# Altium schematic sheet MAKO_pH_sensor_schematic.SchDoc
size A2 portrait; SheetNumber: 1; SheetTotal: 1
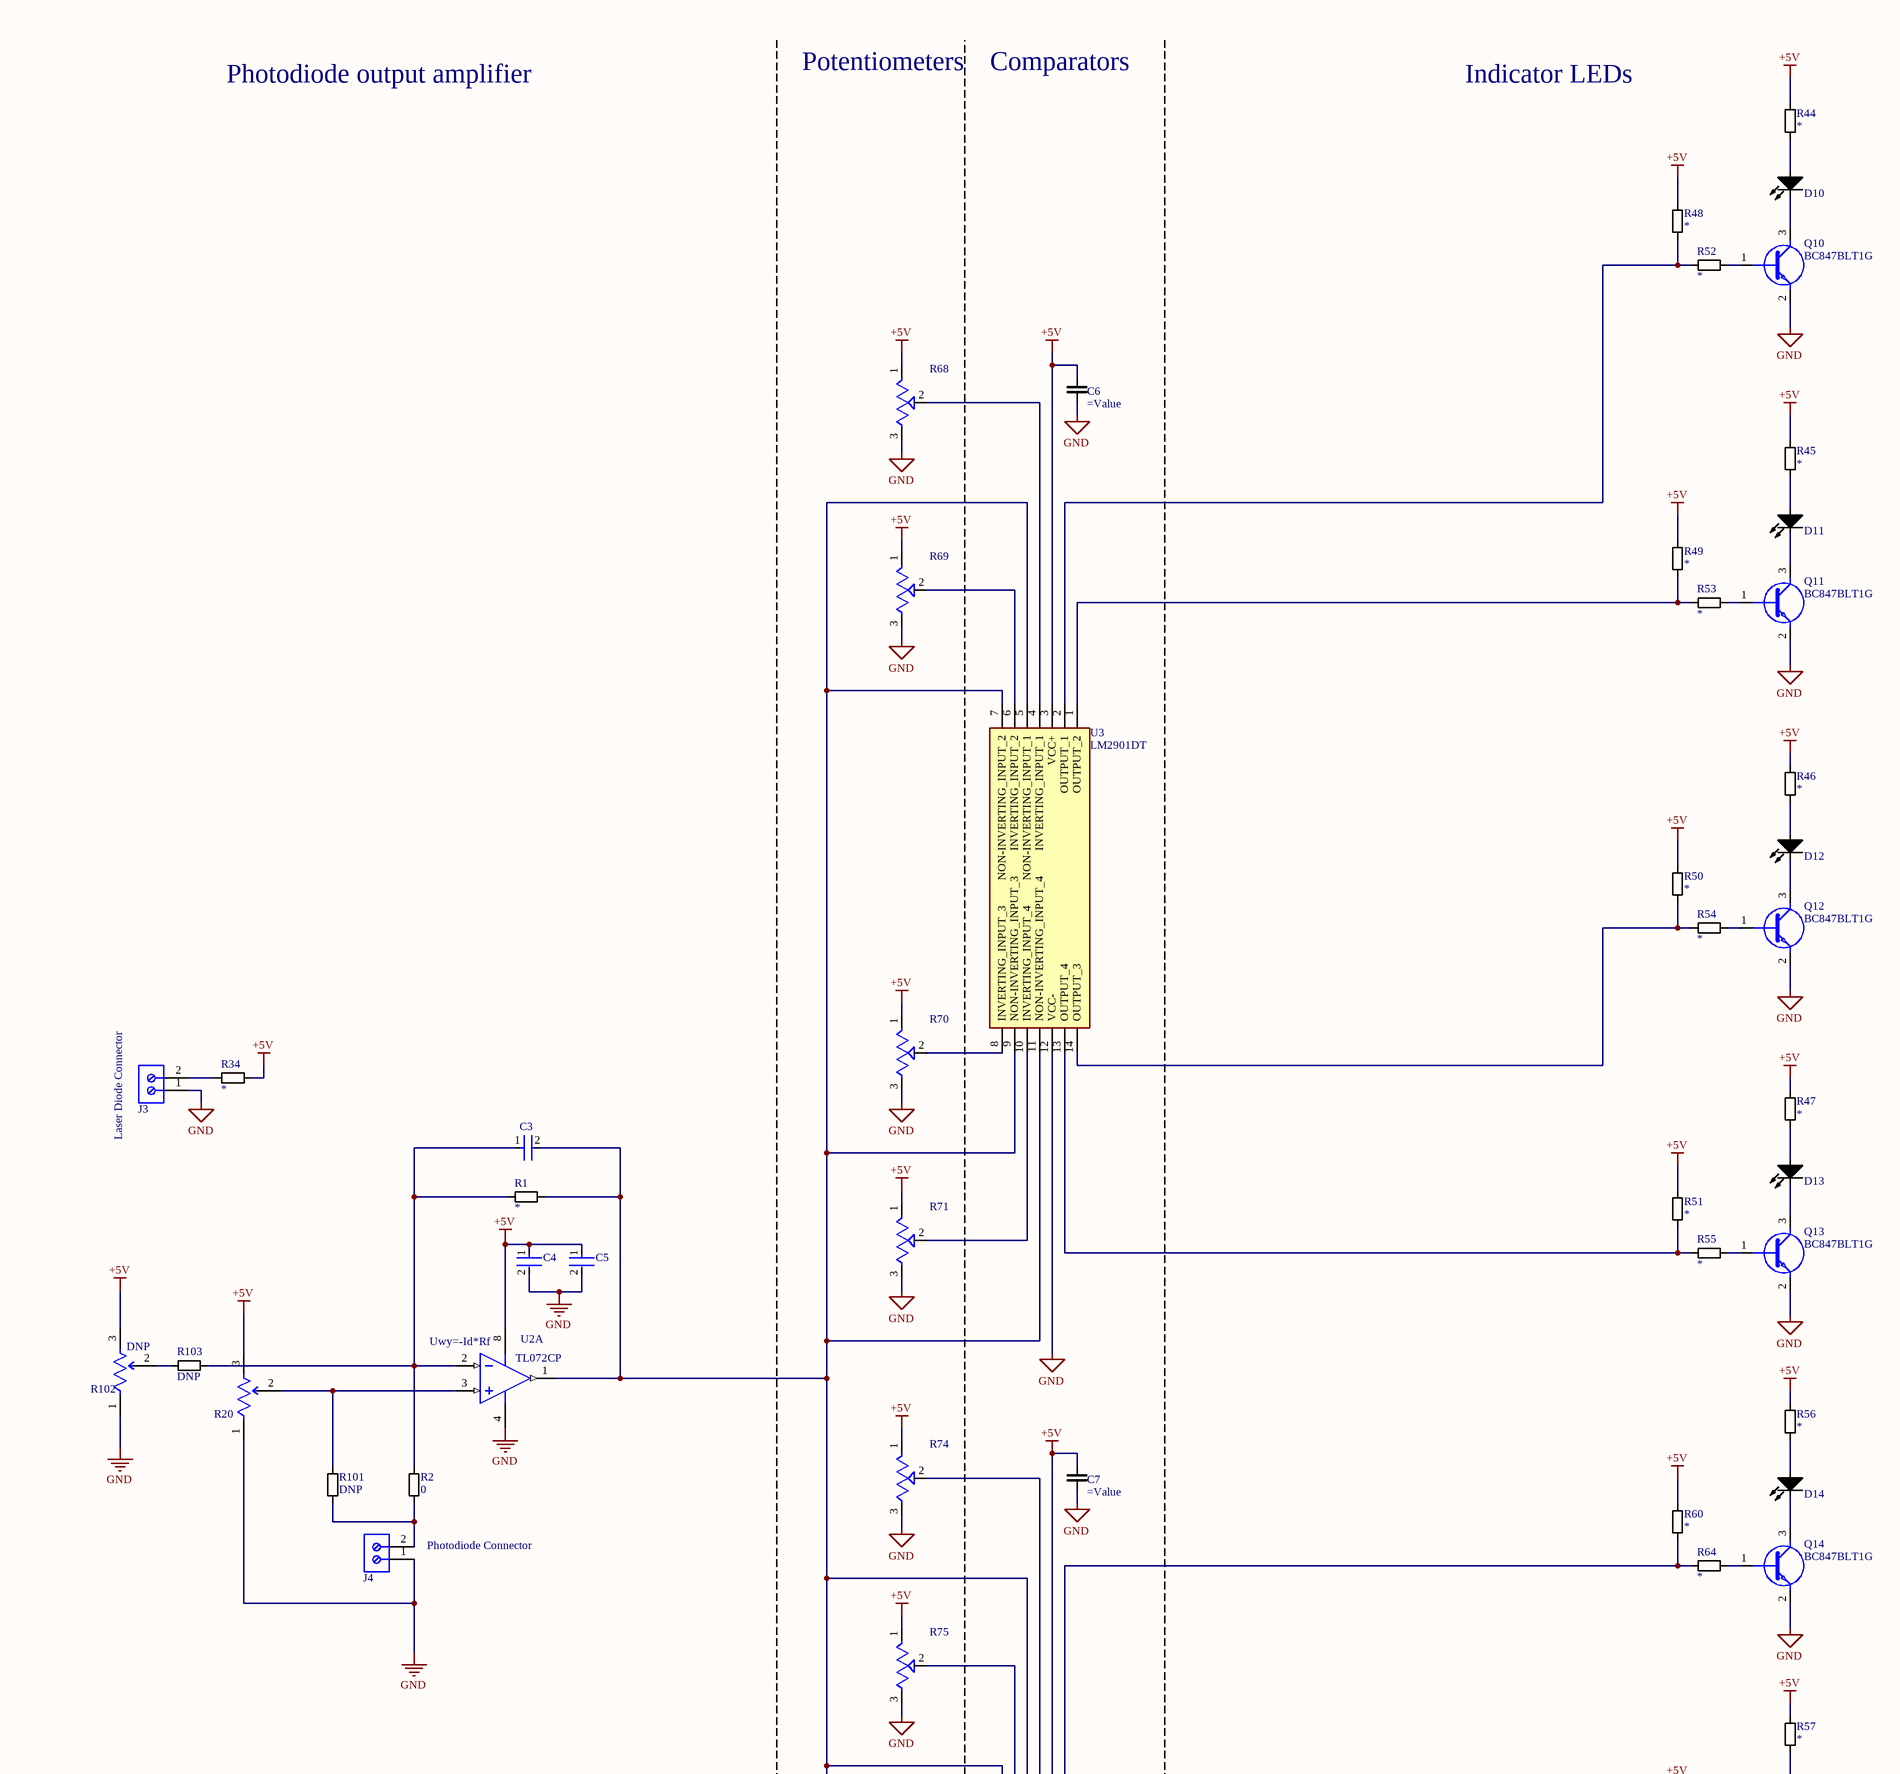
[diagram p0: MAKO_pH_sensor_schematic.SchDoc, top]
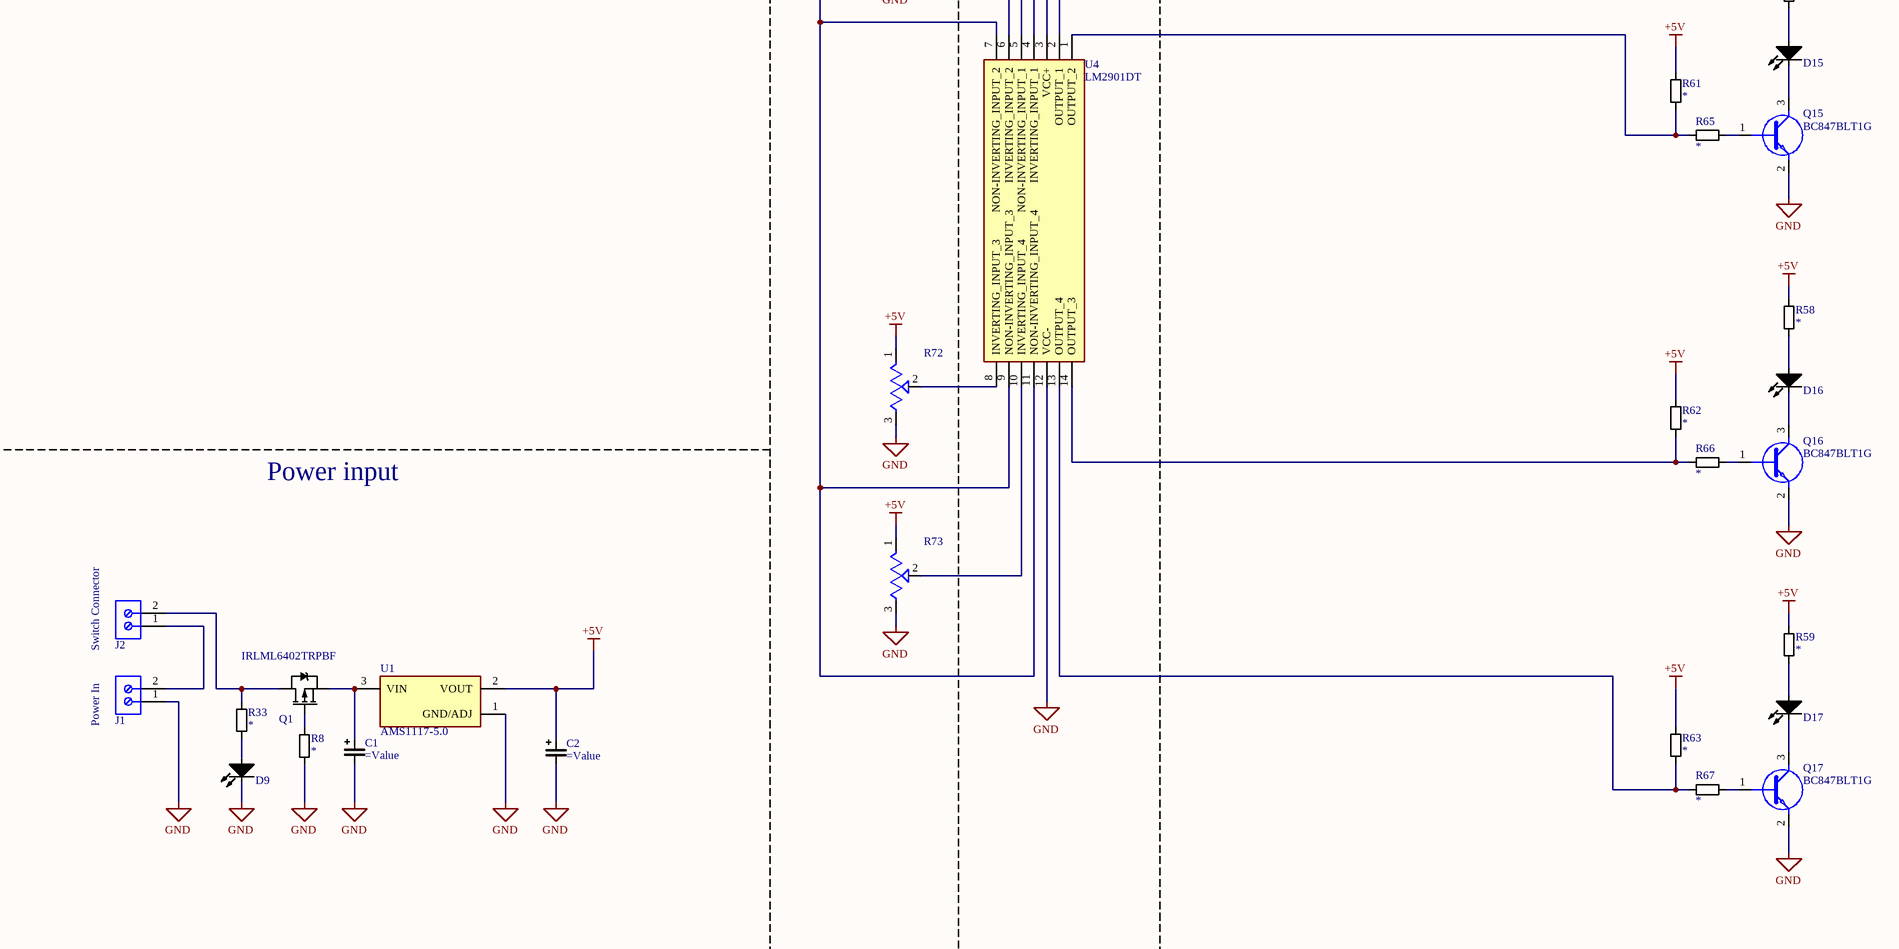
[diagram p1: MAKO_pH_sensor_schematic.SchDoc, bottom]

## Parts
C1  (no value)  [CAPAE530X610N]
C2  (no value)  [CAPAE530X610N]
C3  C1206C102KGRACTU  [FP-C1206C-EF-MFG]  (value not drawn)
C4  C1206C104M5RACTU  [FP-C1206C-EB-MFG]  (value not drawn)
C5  C1206C104M5RACTU  [FP-C1206C-EB-MFG]  (value not drawn)
C6  (no value)  [CAPC1608X90N]
C7  (no value)  [CAPC1608X90N]
D9  (no value)  [151033RS03000]
D10  (no value)  [151033RS03000]
D11  (no value)  [151033RS03000]
D12  (no value)  [151033RS03000]
D13  (no value)  [151033RS03000]
D14  (no value)  [151033RS03000]
D15  (no value)  [151033RS03000]
D16  (no value)  [151033RS03000]
D17  (no value)  [151033RS03000]
J1  691101710002  [RHDRRA2W95P0X500_1X2_1120X900X1280P]  (value not drawn)
J2  691101710002  [RHDRRA2W95P0X500_1X2_1120X900X1280P]  (value not drawn)
J3  691101710002  [RHDRRA2W95P0X500_1X2_1120X900X1280P]  (value not drawn)
J4  691101710002  [RHDRRA2W95P0X500_1X2_1120X900X1280P]  (value not drawn)
Q1  IRLML6402TRPBF  [SOT95P237X112-3N]
Q10  BC847BLT1G  [SOT96P237X111-3N]
Q11  BC847BLT1G  [SOT96P237X111-3N]
Q12  BC847BLT1G  [SOT96P237X111-3N]
Q13  BC847BLT1G  [SOT96P237X111-3N]
Q14  BC847BLT1G  [SOT96P237X111-3N]
Q15  BC847BLT1G  [SOT96P237X111-3N]
Q16  BC847BLT1G  [SOT96P237X111-3N]
Q17  BC847BLT1G  [SOT96P237X111-3N]
R1  *  [CAPC1608X90N]
R2  0  [CAPC1608X90N]
R8  *  [CAPC1608X90N]
R20  3296W-1-103LF  [FP-3296W-MFG]  (value not drawn)
R33  *  [CAPC1608X90N]
R34  *  [CAPC1608X90N]
R44  *  [CAPC1608X90N]
R45  *  [CAPC1608X90N]
R46  *  [CAPC1608X90N]
R47  *  [CAPC1608X90N]
R48  *  [CAPC1608X90N]
R49  *  [CAPC1608X90N]
R50  *  [CAPC1608X90N]
R51  *  [CAPC1608X90N]
R52  *  [CAPC1608X90N]
R53  *  [CAPC1608X90N]
R54  *  [CAPC1608X90N]
R55  *  [CAPC1608X90N]
R56  *  [CAPC1608X90N]
R57  *  [CAPC1608X90N]
R58  *  [CAPC1608X90N]
R59  *  [CAPC1608X90N]
R60  *  [CAPC1608X90N]
R61  *  [CAPC1608X90N]
R62  *  [CAPC1608X90N]
R63  *  [CAPC1608X90N]
R64  *  [CAPC1608X90N]
R65  *  [CAPC1608X90N]
R66  *  [CAPC1608X90N]
R67  *  [CAPC1608X90N]
R68  WH06-2B-10K  [3306F1503]  (value not drawn)
R69  WH06-2B-10K  [3306F1503]  (value not drawn)
R70  WH06-2B-10K  [3306F1503]  (value not drawn)
R71  WH06-2B-10K  [3306F1503]  (value not drawn)
R72  WH06-2B-10K  [3306F1503]  (value not drawn)
R73  WH06-2B-10K  [3306F1503]  (value not drawn)
R74  WH06-2B-10K  [3306F1503]  (value not drawn)
R75  WH06-2B-10K  [3306F1503]  (value not drawn)
R101  DNP  [CAPC1608X90N]
R102  DNP  [FP-3296W-MFG]
R103  DNP  [CAPC1608X90N]
U1  AMS1117-5.0  [S402TS1RP]
U2  TL072CP  [P0008A]  (part A of 2)
U3  LM2901DT  [SOIC127P600X175-14N]
U4  LM2901DT  [SOIC127P600X175-14N]

## Nets
+5V: C2.1 C4.1 C5.1 C6.2 C7.2 R20.3(CW) R34.1 R44.1 R45.1 R46.1 R47.1 R48.1 R49.1 R50.1 R51.1 R56.1 R57.1 R58.1 R59.1 R60.1 R61.1 R62.1 R63.1 R68.1(CCW) R69.1(CCW) R70.1(CCW) R71.1(CCW) R72.1(CCW) R73.1(CCW) R74.1(CCW) R75.1(CCW) R102.3(CW) U1.2(VOUT) U2.8(VCC+) U3.3(VCC+) U4.3(VCC+)
GND: C1.2 C2.2 C4.2 C5.2 C6.1 C7.1 D9.2(K) J1.1 J3.1 J4.1 Q10.2(E) Q11.2(E) Q12.2(E) Q13.2(E) Q14.2(E) Q15.2(E) Q16.2(E) Q17.2(E) R8.1 R20.1(CCW) R68.3(CW) R69.3(CW) R70.3(CW) R71.3(CW) R72.3(CW) R73.3(CW) R74.3(CW) R75.3(CW) R102.1(CCW) U1.1(GND/ADJ) U2.4(VCC-) U3.12(VCC-) U4.12(VCC-)
NetC1_1: C1.1 Q1.3(S) U1.3(VIN)
NetC3_1: C3.1 R1.1 R2.2 R103.1 U2.2(IN1-)
NetC3_2: C3.2 R1.2 U2.1(OUT1) U3.5(NON-INVERTING_INPUT_1) U3.7(NON-INVERTING_INPUT_2) U3.9(NON-INVERTING_INPUT_3) U3.11(NON-INVERTING_INPUT_4) U4.5(NON-INVERTING_INPUT_1) U4.7(NON-INVERTING_INPUT_2) U4.9(NON-INVERTING_INPUT_3) U4.11(NON-INVERTING_INPUT_4)
NetD9_1: D9.1(A) R33.2
NetD10_1: D10.1(A) R44.2
NetD10_2: D10.2(K) Q10.3(C)
NetD11_1: D11.1(A) R45.2
NetD11_2: D11.2(K) Q11.3(C)
NetD12_1: D12.1(A) R46.2
NetD12_2: D12.2(K) Q12.3(C)
NetD13_1: D13.1(A) R47.2
NetD13_2: D13.2(K) Q13.3(C)
NetD14_1: D14.1(A) R56.2
NetD14_2: D14.2(K) Q14.3(C)
NetD15_1: D15.1(A) R57.2
NetD15_2: D15.2(K) Q15.3(C)
NetD16_1: D16.1(A) R58.2
NetD16_2: D16.2(K) Q16.3(C)
NetD17_1: D17.1(A) R59.2
NetD17_2: D17.2(K) Q17.3(C)
NetJ1_2: J1.2 J2.1
NetJ2_2: J2.2 Q1.2(D) R33.1
NetJ3_2: J3.2 R34.2
NetJ4_2: J4.2 R2.1 R101.1
NetQ1_1: Q1.1(G) R8.2
NetQ10_1: Q10.1(B) R52.1
NetQ11_1: Q11.1(B) R53.1
NetQ12_1: Q12.1(B) R54.1
NetQ13_1: Q13.1(B) R55.1
NetQ14_1: Q14.1(B) R64.1
NetQ15_1: Q15.1(B) R65.1
NetQ16_1: Q16.1(B) R66.1
NetQ17_1: Q17.1(B) R67.1
NetR20_2: R20.2(WIPER) R101.2 U2.3(IN1+)
NetR48_2: R48.2 R52.2 U3.2(OUTPUT_1)
NetR49_2: R49.2 R53.2 U3.1(OUTPUT_2)
NetR50_2: R50.2 R54.2 U3.14(OUTPUT_3)
NetR51_2: R51.2 R55.2 U3.13(OUTPUT_4)
NetR60_2: R60.2 R64.2 U4.2(OUTPUT_1)
NetR61_2: R61.2 R65.2 U4.1(OUTPUT_2)
NetR62_2: R62.2 R66.2 U4.14(OUTPUT_3)
NetR63_2: R63.2 R67.2 U4.13(OUTPUT_4)
NetR68_2: R68.2(W) U3.4(INVERTING_INPUT_1)
NetR69_2: R69.2(W) U3.6(INVERTING_INPUT_2)
NetR70_2: R70.2(W) U3.8(INVERTING_INPUT_3)
NetR71_2: R71.2(W) U3.10(INVERTING_INPUT_4)
NetR72_2: R72.2(W) U4.8(INVERTING_INPUT_3)
NetR73_2: R73.2(W) U4.10(INVERTING_INPUT_4)
NetR74_2: R74.2(W) U4.4(INVERTING_INPUT_1)
NetR75_2: R75.2(W) U4.6(INVERTING_INPUT_2)
NetR102_2: R102.2(WIPER) R103.2

## Notes on the sheet
- Photodiode output amplifier
- Potentiometers
- Comparators
- Indicator LEDs
- (near J3) Laser Diode Connector
- (near U2) Uwy=-Id*Rf
- Photodiode Connector
- Power input
- Switch Connector
- (near J1) Power In

## Library data of the parts
C1 C2 = CapPol: Ceramic capacitor
C3 = CMP-03020-034681-1: CAP CER 1000PF 2KV X7R 1206; Tolerance: 10%; Capacitance: 1nF; Dissipation Factor: 2.5%; Dielectric Material: Ceramic; Voltage Rating (DC): 2.5kV; Voltage: 2kV; REACH SVHC: No SVHC; Height: 1.6mm; Construction: Flat; Case/Package: 1206; Series: C; Mount: Surface Mount; RoHS Compliant: Yes; Package Quantity: 1; Length: 3.2mm; Width: 0.063inch; Voltage Rating: 2kV; Min Operating Temperature: -55°C; Case Code (Metric): 3216; Termination: SMD/SMT; Number of Pins: 2; Case Code (Imperial): 1206; Packaging: Tape and Reel; Dielectric: X7R; Thickness: 0.069inch; Depth: 1.6mm; Radiation Hardening: No; Max Operating Temperature: 125°C
C4 C5 = CMP-03020-028488-1: CAP CER 0.1UF 50V X7R 1206; Manufacturer: KEMET; Material: Ceramic; Automotive Grade: Grade 0; Value: 0.10 μF; Tolerance: 0.2; Temperature Coefficient: 15%; Device Class L3: Ceramic Capacitors; Device Class L1: Passive Components; Category: Cap; Octopart: https://octopart.com/c1206c104m5ractu-kemet-129344; Temperature Range Low: -55°C; RoHS: TRUE; Manufacturer Part Number: C1206C104M5RACTU; Lead Free: Yes; Package: C1206C-EB; Digikey Description: CAP CER 0.1UF 50V X7R 1206; Automotive: Yes; Capacitance: 0.10 μF; Height: 0.88mm; Device Class L2: Capacitors; ComponentLink2Description: Datasheet; Mouser Description: Multilayer Ceramic Capacitors MLCC - SMD/SMT 50volts 0.1uF X7R 20%; Temperature: -55°C to +150°C; Temperature Characteristic: X7R; ComponentLink2URL: https://content.kemet.com/datasheets/KEM_C1007_X8R_ULTRA_150C_SMD.pdf; Ipc Land Pattern Name: CAPC320160X78; Temperature Range High: +150°C; Voltage Rating: 50 V
C6 C7 = Cap: Ceramic capacitor
D9-D17 = LED
J1-J4 = 691101710002: WR-TBL Series 101 Horizontal Entry Modular, THT, pitch 5mm, 2p; Manufacturer: Wurth Elektronik; Modularity: Yes; Rated Current: 16A; Working Voltage: 250V; ComponentLink1Description: Website Link; ComponentLink1URL: https://www.we-online.com/redexpert/article/691101710002?ad; ComponentLink2Description: Datasheet Link; ComponentLink2URL: https://www.we-online.com/redexpert/spec/691101710002?ad; Manufacturer Part Number: 691101710002; Category: Terminal Blocks; Match Code: WR-TBL; Mount: Through Hole; Operating Temperature Max: 105°C; Operating Temperature Min: -40°C; Packaging: Box; Application: Pressure Clamp; Number of Pins: 2; Number of Rows: 1; Orientation: Horizontal; Pitch: 5mm
Q1 = PMOSFET
Q10-Q17 = BC847BLT1G: Transistor NPN 45V 100mA hfe200 SOT23 ON Semi BC847BLT1G NPN Bipolar Transistor, 0.1 A, 45 V, 3-Pin SOT-23; Manufacturer_Name: onsemi; Geometry.Height: 1.11mm; Mouser Part Number: 863-BC847BLT1G; Mouser Price/Stock: https://www.mouser.co.uk/ProductDetail/onsemi/BC847BLT1G?qs=vNc2DXHODiLAH81QlkcRzw%3D%3D; Manufacturer_Part_Number: BC847BLT1G; Datasheet Link: http://www.onsemi.com/pub/Collateral/BC846ALT1-D.PDF
R1 R2 R8 R33 R34 R44-R67 R101 R103 = RES: Resistor
  R1 R8 R33 R34 R44-R67 R101 R103: Value: *
  R2: Value: 0
R20 R102 = CMP-1747-00001-8: TRIMMER 10K OHM 0.5W PC PIN TOP / 3296W-1-103LF; Number of Turns: 25; Tolerance: 10%; Resistance: 10kR; Max Power Dissipation: 500mW; Temperature Coefficient: 100ppm/°C; Insulation Resistance: 1GR; Min Operating Temperature: -55°C; Resistor Type: Cermet; Series: 3296; Color: Blue; Mount: Through Hole; Taper: Linear; Radiation Hardening: No; RoHS Compliant: Yes; Width: 9.53mm; Resistance Tolerance: 10%; Contact Plating: Tin; Military Standard: Not; Package Quantity: 50; Weight: 0.03oz; Lead Free: Lead Free; Power Rating: 500mW; Termination: Pin; Technology: CERMET; Max Operating Temperature: 125°C; Packaging: Rail/Tube; Length: 9.53mm; Depth: 4.83mm; Height: 11.55mm; Reach SVHC Compliant: Yes
R68-R75 = 3306F-1-103: 10 kOhms 0.2W, 1/5W PC Pins Through Hole Trimmer Potentiometer Cermet 1 Turn Top Adjustment; MF: Bourns; Value: *; Availability: Unavailable; Price: None; Package: 6432 Bourns; MP: 3306F-1-103; SnapEDA_Link: https://www.snapeda.com/parts/3306F-1-103/Bourns/view-part/293813/?ref=snap
U1 = AMS1117-5.0: 1A LOW DROPOUT VOLTAGE REGULATOR; MF: ams; MP: AMS1117-5.0; Package: SOT-223 Seeed Technology; SnapEDA_Link: https://www.snapeda.com/parts/AMS1117-5.0/ams/view-part/?ref=snap; Check_prices: https://www.snapeda.com/parts/AMS1117-5.0/ams/view-part/?ref=eda; Availability: Not in stock; Value: *; Price: None
U2 = CMP-0017-00950-2: Dual Low-Noise JFET-Input General-Purpose Operational Amplifier, 7 to 36 V, 0 to 70 degC, 8-pin DIP (P8), Pb-Free (RoHS); Manufacturer: Texas Instruments; Sub Family: General Purpose Amplifier, High Supply Voltage Amplifier (>=30V); Total Supply Voltage(Max)(+5V is 5, +/-5V is 10): 36; Slew Rate(Typ)(V/us): 13; Vn at 1kHz(Typ)(nV/rtHz): 18; GBW(Typ)(MHz): 3; CMRR(Min)(dB): 70; Total Supply Voltage(Min)(+5V is 5, +/-5V is 10): 7; Vio (25C)(Max)(mV): 10; Rating: Catalog; IIB(Max)(pA): 200; Iq per channel(Max)(mA): 2.5; Number of Channels: 2; Mounting Technology: Through Hole; ComponentLink3Description: Package Specification; PartNumber: TL072CP; PackageVersion: 4040082/E, 04/2010; Eco-Plan: Pb-Free (RoHS); DatasheetVersion: SLOS080J; Offset Drift(Typ)(uV/C): 18; ComponentLink3URL: http://www.ti.com/litv/pdf/mpdi001b; PackageDescription: 8-Pin Plastic In-Line, Body 9.59 x 6.35 mm, Pitch 2.54 mm; Code_JEDEC: MS-001; ComponentLink2URL: http://www.ti.com/lit/ds/symlink/tl072.pdf; ComponentLink1Description: Manufacturer URL; ComponentLink2Description: Datasheet; ComponentLink1URL: http://www.ti.com/; PackageReference: P0008A
U3 U4 = LM2901DT: LM2901DT, Quad Comparator Open Collector 1.3us 12 V, 15 V, 18 V, 24 V, 28 V, 3 V, 5 V, 9 V 14-Pin SO; Manufacturer_Name: STMicroelectronics; Geometry.Height: 1.75mm; Mouser Part Number: 511-LM2901DT; Mouser Price/Stock: https://www.mouser.co.uk/ProductDetail/STMicroelectronics/LM2901DT?qs=dKKAVK9nnHN1RlpYJ88XIQ%3D%3D; Manufacturer_Part_Number: LM2901DT; Datasheet Link: http://www.st.com/st-web-ui/static/active/en/resource/technical/document/datasheet/CD00000532.pdf